# EAGLE design spinbitboard (EAGLE 7.2.0)
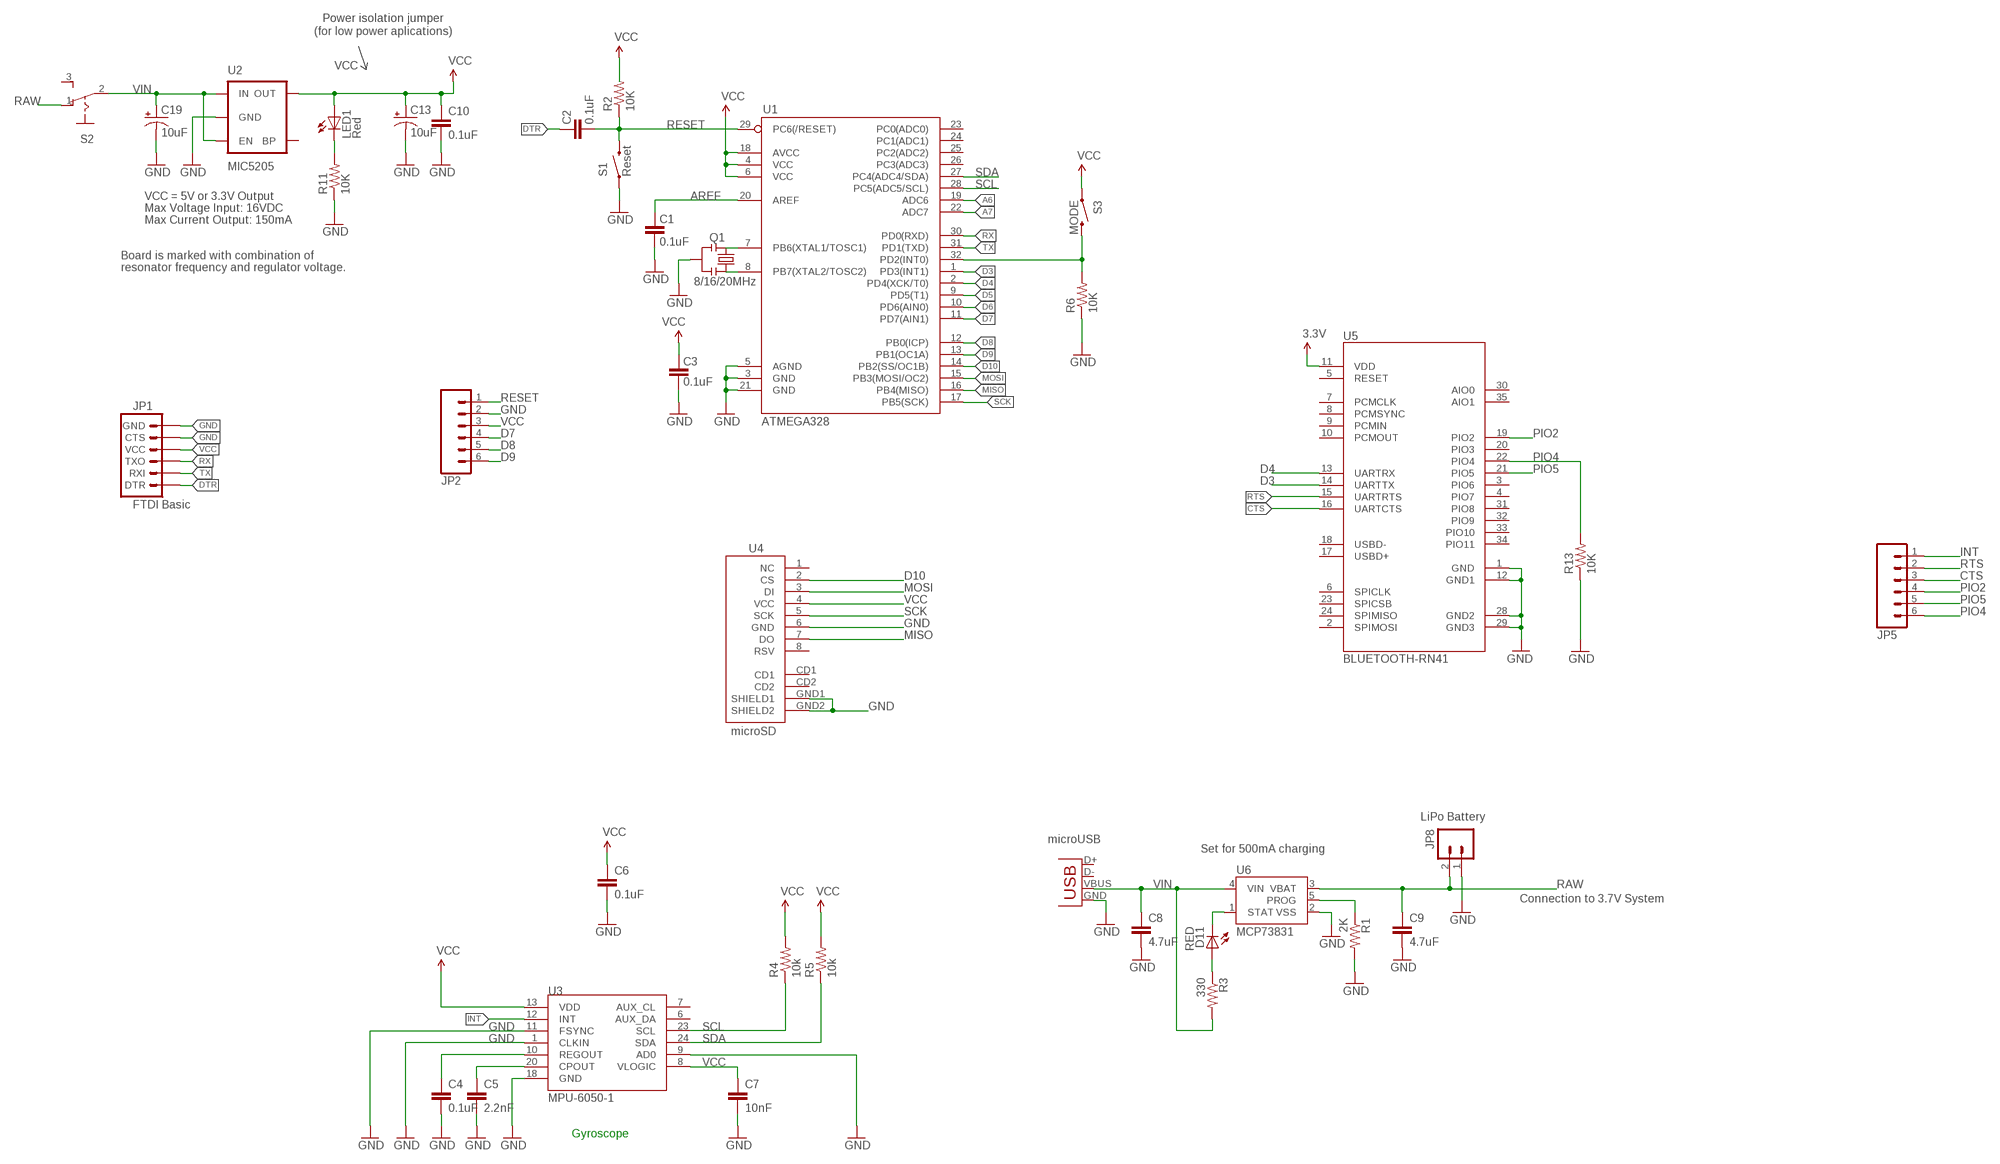
[diagram p0: schematic, sheet 1]

## Parts
C1  0.1uF  CAP0603-CAP  [0603-CAP]
C2  0.1uF  CAP0603-CAP  [0603-CAP]
C3  0.1uF  CAP0603-CAP  [0603-CAP]
C4  0.1uF  CAP0603-CAP  [0603-CAP]
C5  2.2nF  CAP0603-CAP  [0603-CAP]
C6  0.1uF  CAP0603-CAP  [0603-CAP]
C7  10nF  CAP0603-CAP  [0603-CAP]
C8  4.7uF  C-EUC0603  [C0603]
C9  4.7uF  C-EUC0603  [C0603]
C10  0.1uF  CAP0603-CAP  [0603-CAP]
C13  10uF  CAP_POL1206  [EIA3216]
C19  10uF  CAP_POL1206  [EIA3216]
D11  RED  LED0603  [LED-0603]
JP1  FTDI Basic  ARDUINO_SERIAL_PROGRAMPTH  [1X06]
JP2  M06SIP  [1X06]
JP5  M06SIP  [1X06]
JP8  LiPo Battery  M02-JST-2MM-SMT  [JST-2-SMD]
LED1  Red  LED  [0603-LED-ALT1]
Q1  8/16/20MHz  RESONATOR1:1  [RESONATOR-SMD-1:1]
R1  2K  R-US_R0603  [R0603]
R2  10K  RESISTOR0603-RES  [0603-RES]
R3  330  R-US_R0603  [R0603]
R4  10k  RESISTOR0603-RES  [0603-RES]
R5  10k  RESISTOR0603-RES  [0603-RES]
R6  10K  RESISTOR0603-RES  [0603-RES]
R11  10K  RESISTOR0603-RES  [0603-RES]
R13  10K  RESISTOR0603-RES  [0603-RES]
S1  Reset  SWITCH-MOMENTARY-2SMD-ALT01  [TACTILE-SWITCH-SMD-ALT01]
S2  255SB  [255SB]
S3  MODE  SWITCH-MOMENTARY-2SMD-ALT01  [TACTILE-SWITCH-SMD-ALT01]
U1  ATMEGA328  ATMEGA168  [TQFP32-08]
U2  MIC5205  V_REG_LDOSMD  [SOT23-5]
U3  MPU-6050-1  [QFN-24-4MM2]
U4  microSD  USD-SOCKETSMD  [MICRO-SD-SOCKET-PP]
U5  BLUETOOTH-RN41  BLUETOOTH-RN41"  [RN41]
U6  MCP73831  [SOT23-5]
X1  Micro USB  USB-MICROB  [USB-MICROB]

## Nets
3.3V: C6.1 R4.2 R5.2 S3.1 S3.2 U3.13(VDD) ; supply symbol labelled VCC
A6: U1.19(ADC6)
A7: U1.22(ADC7)
AREF: C1.2 U1.20(AREF)
CTS: JP5.3 U5.16(UARTCTS)
D2: R6.2 S3.3 S3.4 U1.32(PD2(INT0))
D3: U1.1(PD3(INT1)) U5.14(UARTTX)
D4: U1.2(PD4(XCK/T0)) U5.13(UARTRX)
D5: U1.9(PD5(T1))
D6: U1.10(PD6(AIN0))
D7: JP2.4 U1.11(PD7(AIN1))
D8: JP2.5 U1.12(PB0(ICP))
D9: JP2.6 U1.13(PB1(OC1A))
D10: U1.14(PB2(SS/OC1B)) U4.2(CS)
DTR: C2.2 JP1.1(DTR)
GND [vcc]: C1.1 C3.1 C4.2 C5.2 C6.2 C7.2 C8.2 C9.2 C10.2 C13.C(-) C19.C(-) JP1.5(CTS) JP1.6(GND) JP2.2 JP8.1 Q1.2 R1.2 R6.1 R11.1 R13.1 S1.1 S1.2 U1.3(GND) U1.5(AGND) U1.21(GND) U2.2(GND) U3.1(CLKIN) U3.9(AD0) U3.11(FSYNC) U3.18(GND) U4.6(GND) U4.GND1(SHIELD1) U4.GND2(SHIELD2) U5.1(GND) U5.12(GND1) U5.28(GND2) U5.29(GND3) U6.2(VSS) X1.GND
INT: JP5.1 U3.12(INT)
MISO: U1.16(PB4(MISO)) U4.7(DO)
MOSI: U1.15(PB3(MOSI/OC2)) U4.3(DI)
N$1: Q1.3 U1.8(PB7(XTAL2/TOSC2))
N$2: Q1.1 U1.7(PB6(XTAL1/TOSC1))
N$4: LED1.C R11.2
N$5: C5.1 U3.20(CPOUT)
N$6: C4.1 U3.10(REGOUT)
N$7: D11.A R3.1
PIO2: JP5.4 U5.19(PIO2)
PIO4: JP5.6 R13.2 U5.22(PIO4)
PIO5: JP5.5 U5.21(PIO5)
PROG: R1.1 U6.5(PROG)
RAW [vcc]: C9.1 JP8.2 S2.1(O) U6.3(VBAT)
RESET: C2.1 JP2.1 R2.1 S1.3 S1.4 U1.29(PC6(/RESET))
RTS: JP5.2 U5.15(UARTRTS)
RX: JP1.3(TXO) U1.30(PD0(RXD))
SCK: U1.17(PB5(SCK)) U4.5(SCK)
SCL: R4.1 U1.28(PC5(ADC5/SCL)) U3.23(SCL)
SDA: R5.1 U1.27(PC4(ADC4/SDA)) U3.24(SDA)
STAT: D11.C U6.1(STAT)
TX: JP1.2(RXI) U1.31(PD1(TXD))
VCC: C3.2 C7.1 C10.1 C13.A(+) JP1.4(VCC) JP2.3 LED1.A R2.2 U1.4(VCC) U1.6(VCC) U1.18(AVCC) U2.5(OUT) U3.8(VLOGIC) U4.4(VCC) U5.11(VDD) ; supply symbol labelled 3.3V
VIN: C8.1 C19.A(+) R3.2 S2.2(P) U2.1(IN) U2.3(EN) U6.4(VIN) X1.VBUS
Unconnected: S2.3(S) U1.23(PC0(ADC0)) U1.24(PC1(ADC1)) U1.25(PC2(ADC2)) U1.26(PC3(ADC3)) U2.4(BP) U3.6(AUX_DA) U3.7(AUX_CL) U4.1(NC) U4.8(RSV) U4.CD1 U4.CD2 U5.2(SPIMOSI) U5.3(PIO6) U5.4(PIO7) U5.5(RESET) U5.6(SPICLK) U5.7(PCMCLK) U5.8(PCMSYNC) U5.9(PCMIN) U5.10(PCMOUT) U5.17(USBD+) U5.18(USBD-) U5.20(PIO3) U5.23(SPICSB) U5.24(SPIMISO) U5.30(AIO0) U5.31(PIO8) U5.32(PIO9) U5.33(PIO10) U5.34(PIO11) U5.35(AIO1) X1.D+ X1.D-

## Notes on the sheet
- Power isolation jumper
- (for low power aplications)
- VCC = 5V or 3.3V Output
- Max Voltage Input: 16VDC
- Max Current Output: 150mA
- Board is marked with combination of
- resonator frequency and regulator voltage.
- microUSB
- Set for 500mA charging
- Connection to 3.7V System
- Gyroscope

## Library data of the parts
C1-C7 C10 = SparkFun:CAP: Capacitor Standard 0603 ceramic capacitor, and 0.1" leaded capacitor.
C8 C9 = resistor:C-EU: CAPACITOR, European symbol
C13 C19 = SparkFun:CAP_POL: Capacitor Polarized These are standard SMD and PTH capacitors. Normally 10uF, 47uF, and 100uF in electrolytic and tantalum varieties. Always verify the external diameter of the through hole cap, it varies with capacity, voltage, and manufacturer. The EIA devices should be standard.
D11 = SparkFun:LED: LEDs Standard schematic elements and footprints for 5mm, 3mm, 1206, and 0603 sized LEDs. 5mm - Spark Fun Electronics SKU : COM-00529 (and others)
JP1 = SparkFun:ARDUINO_SERIAL_PROGRAM
JP2 JP5 = SparkFun:M06: Header 6 Standard 6-pin 0.1" header. Use with straight break away headers (SKU : PRT-00116), right angle break away headers (PRT-00553), swiss pins (PRT-00743), machine pins (PRT-00117), and female headers (PRT-00115). Molex polarized connector foot print use with SKU : PRT-08094 with associated crimp pins and housings. NOTES ON THE VARIANTS LOCK and LOCK_LONGPADS... This footprint was designed to help hold the alignment of a through-hole component (i.e. 6-pin header) while soldering it into place. You may notice that each hole has been shifted either up or down by 0.005 of an inch from it's more standard position (which is a perfectly straight line). This slight alteration caused the pins (the squares in the middle) to touch the edges of the holes. Because they are alternating, it causes a "brace" to hold the component in place. 0.005 has proven to be the perfect amount of "off-center" position when using our standard breakaway headers. Although looks a little odd when you look at the bare footprint, once you have a header in there, the alteration is very hard to notice. Also, if you push a header all the way into place, it is covered up entirely on the bottom side. This idea of altering the position of holes to aid alignment will be further integrated into the Sparkfun Library for other footprints. It can help hold any component with 3 or more connection pins.
JP8 = SparkFun:M02: Header 2 Standard 2-pin 0.1" header. Use with straight break away headers (SKU : PRT-00116), right angle break away headers (PRT-00553), swiss pins (PRT-00743), machine pins (PRT-00117), and female headers (PRT-00115). Molex polarized connector foot print use with SKU : PRT-08233 with associated crimp pins and housings.
LED1 = Testing:LED: LEDs Standard schematic elements and footprints for 5mm, 3mm, 1206, and 0603 sized LEDs. 5mm - Spark Fun Electronics SKU : COM-00529 (and others)
Q1 = Testing:RESONATOR: Resonator Small SMD resonator. This is the itty bitty 10/20MHz resonators with built in caps. CSTCE10M0G55 and CSTCE20M0V53. Footprint for SMD has been used in SFE production for years, and does work okay. 1:1 is an attempt to get larger fillets on the sides so it will be easier to inspect these solders in our AOI machine. The pads have been minimized to match the actual metal under the resonator. To see this relation, it includes an image import of the bottom side of the component. Imported to scale on layer 200.
R1 R3 = resistor:R-US_: RESISTOR, American symbol
R2 R4-R6 R11 R13 = SparkFun:RESISTOR: Resistor Basic schematic elements and footprints for 0603, 1206, and PTH resistors.
S1 S3 = Testing:SWITCH-MOMENTARY-2: Various NO switches- pushbuttons, reed, etc
S2 = switch:255SB: SLIDING SWITCH Distributor Buerklin, 11G810
U1 = SparkFun:ATMEGA168
U2 = SparkFun:V_REG_LDO: Voltage Regulator LDO Standard 150mA LDO voltage regulator in SOT-23 layout. Micrel part MIC5205. BP (by-pass) pin is used to lower output noise with 470pF cap.
U3 = Testing:MPU-6050
U4 = SparkFun:USD-SOCKET: microSD Socket Push-push type uSD socket. Schematic element and footprint production proven. Spark Fun Electronics SKU : PRT-00127. tDoc lines correctly indicate media card edge positions when inserting (unlocked, locked, depressed).
U5 = SparkFun-RF:BLUETOOTH-RN41: Bluetooth SMD module
U6 = SparkFun:MCP73831: Microchip's MCP73831 Miniature single cell, fully integrated Li-Ion, Li-polymer charge management controller http://ww1.microchip.com/downloads/en/DeviceDoc/21984a.pdf
X1 = SparkFun:USB: USB Connectors USB-B-PTH is fully proven SKU : PRT-00139 USB-miniB is fully proven SKU : PRT-00587 USB-A-PCB is untested. USB-A-H is throughly reviewed, but untested. Spark Fun Electronics SKU : PRT-00437 USB-B-SMT is throughly reviewed, but untested. Needs silkscreen touching up. USB-A-S has not been used/tested USB-MB-H has not been used/tested

## Net classes
1 vcc: width 0.254 mm

## Board
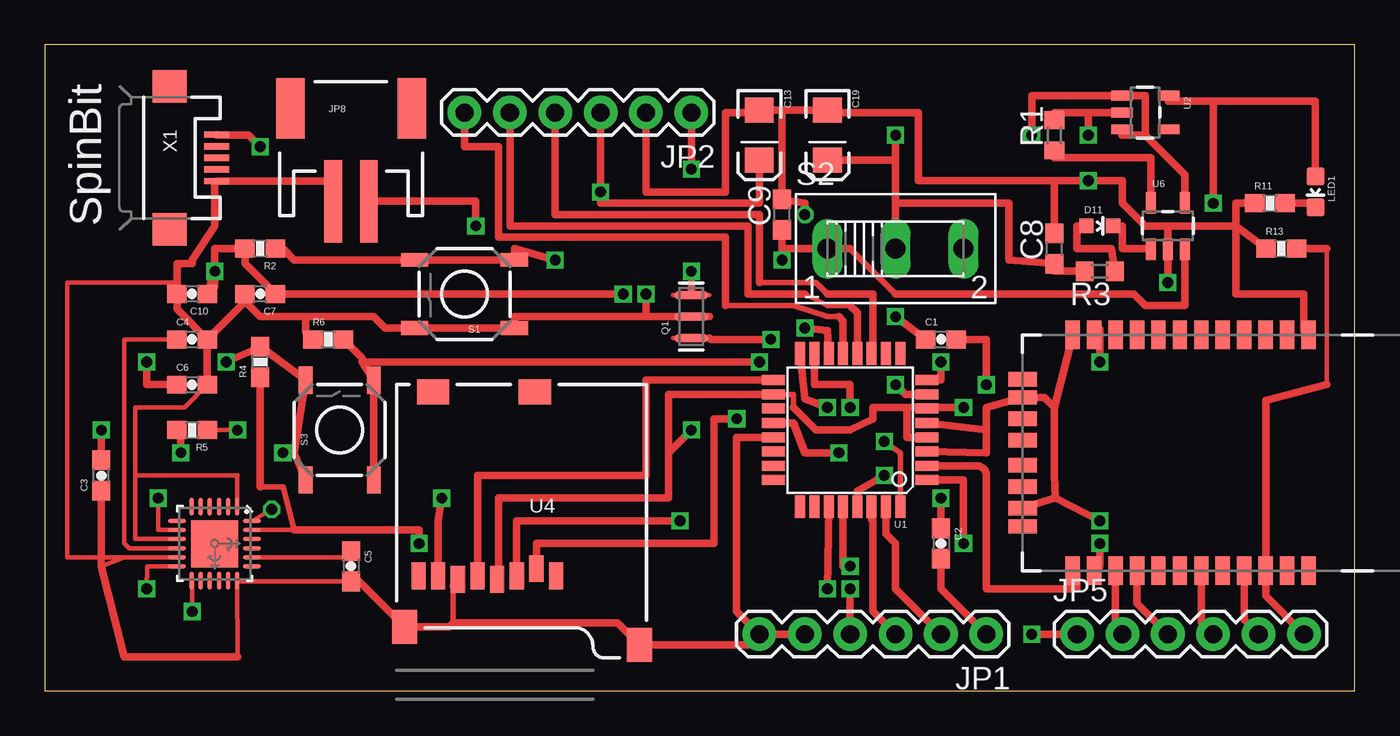
[diagram p1: board, top side]
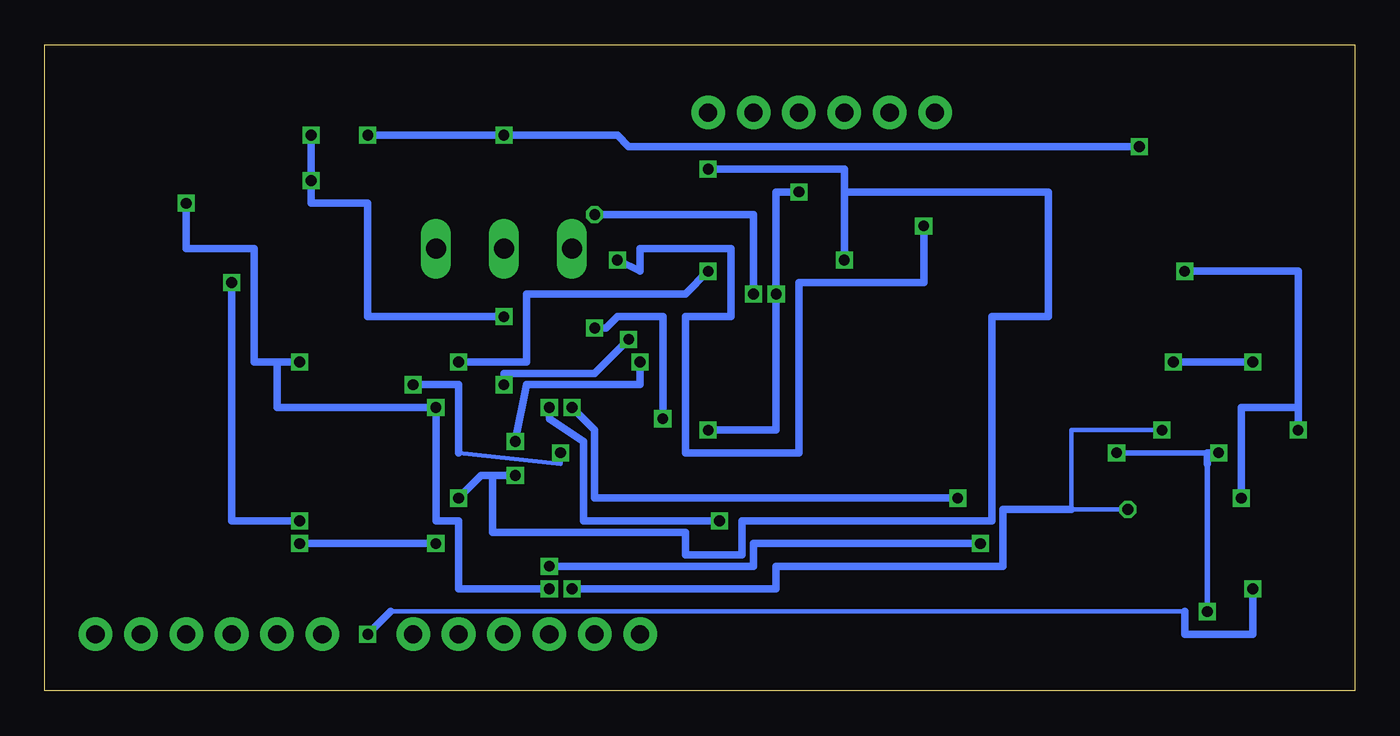
[diagram p2: board, bottom side, seen from below]

Size 73.33 x 36.18 mm. Coordinates in mm from the lower left corner, seen from the top.
Outline: 0,0 73.33,0 73.33,36.18 0,36.18 0,0
Copper layers (1*16): Top 0.0356mm / dielectric 1.5011mm / Bottom 0.0356mm
Design rules "LaenPCBOrder": minimum track width 6mil, minimum drill 13mil, track to track 6mil, track to pad 6mil, pad to pad 6mil, via to via 6mil, smd to smd 6mil, copper to edge 15mil, drill to drill 6mil, minimum pad ring 7mil, minimum via ring 7mil, stop-mask expansion 3mil, vias tented up to drill 0mil, thermal gap 10mil

### Footprints (pad centres in the part's own frame; a part is rotated, then mirrored left to right if it is on the bottom)
0603-CAP = smd 1.1 x 1: 1 -0.85,0; 2 0.85,0
C0603 = smd 1.1 x 1: 1 -0.85,0; 2 0.85,0
EIA3216 = smd 1.4 x 1.6: A 1.4,0; C -1.4,0
LED-0603 = smd 0.8 x 0.8: A 0,-0.75; C 0,0.75
1X06 = drill 1.016 pad 1.88: 1 0,0; 2 2.54,0; 3 5.08,0; 4 7.62,0; 5 10.16,0; 6 12.7,0
JST-2-SMD = smd 1 x 4.6: 1 -1,-3.7; 2 1,-3.7 | smd 1.6 x 3.4: NC1 -3.4,1.5; NC2 3.4,1.5
0603-LED-ALT1 = smd 1 x 1: A 0,-0.877; C 0,0.877
RESONATOR-SMD-1:1 = smd 0.45 x 1.905: 1 -1.2,0; 2 0,0; 3 1.2,0
R0603 = smd 1 x 1.1: 1 -0.85,0; 2 0.85,0
0603-RES = smd 1.1 x 1: 1 -0.85,0; 2 0.85,0
TACTILE-SWITCH-SMD-ALT01 = smd 1.524 x 0.762: 1 -2.794,1.905; 2 2.794,1.905; 3 -2.794,-1.905; 4 2.794,-1.905
255SB = drill 1.118 long: 1 -3.81,0; 2 0,0; 3 3.81,0
TQFP32-08 = smd 1.27 x 0.559: 1 -4.293,2.8; 2 -4.293,2; 3 -4.293,1.2; 4 -4.293,0.4; 5 -4.293,-0.4; 6 -4.293,-1.2; 7 -4.293,-2; 8 -4.293,-2.8; 17 4.293,-2.8; 18 4.293,-2; 19 4.293,-1.2; 20 4.293,-0.4; 21 4.293,0.4; 22 4.293,1.2; 23 4.293,2; 24 4.293,2.8 | smd 0.559 x 1.27: 9 -2.8,-4.293; 10 -2,-4.293; 11 -1.2,-4.293; 12 -0.4,-4.293; 13 0.4,-4.293; 14 1.2,-4.293; 15 2,-4.293; 16 2.8,-4.293; 25 2.8,4.293; 26 2,4.293; 27 1.2,4.293; 28 0.4,4.293; 29 -0.4,4.293; 30 -1.2,4.293; 31 -2,4.293; 32 -2.8,4.293
SOT23-5 = smd 0.55 x 1.2: 1 -0.95,-1.3; 2 0,-1.3; 3 0.95,-1.3; 4 0.95,1.3; 5 -0.95,1.3
QFN-24-4MM2 = smd 1.016 x 0.254: 1 -2.066,1.257; 2 -2.066,0.75; 3 -2.066,0.247; 4 -2.066,-0.287; 5 -2.066,-0.792; 6 -2.066,-1.297; 13 2.086,-1.297; 14 2.086,-0.792; 15 2.086,-0.287; 16 2.086,0.247; 17 2.086,0.75; 18 2.086,1.257 | smd 0.254 x 1.016: 7 -1.267,-2.122; 8 -0.762,-2.122; 9 -0.258,-2.122; 10 0.278,-2.122; 11 0.78,-2.122; 12 1.287,-2.122; 19 1.287,2.082; 20 0.78,2.082; 21 0.278,2.082; 22 -0.258,2.082; 23 -0.762,2.082; 24 -1.267,2.082 | smd 2.616 x 2.616: P$1 0.02,-0.01
MICRO-SD-SOCKET-PP = smd 0.8 x 1.5: 1 -8.94,10.7; 2 -7.84,10.3; 3 -6.74,10.7; 4 -5.64,10.9; 5 -4.54,10.7; 6 -3.44,10.9; 7 -2.34,10.7; 8 -1.24,10.7 | smd 1.8 x 1.4: CD1 -7.75,0.4; CD2 -2.05,0.4 | smd 1.4 x 1.9: GND1 -13.6,14.55; GND2 -0.45,13.55
RN41 = smd 0.8 x 1.6: 1 -6.6,-6.6; 2 -5.4,-6.6; 3 -4.2,-6.6; 4 -3,-6.6; 5 -1.8,-6.6; 6 -0.6,-6.6; 7 0.6,-6.6; 8 1.8,-6.6; 9 3,-6.6; 10 4.2,-6.6; 11 5.4,-6.6; 12 6.6,-6.6; 13 6.6,6.6; 14 5.4,6.6; 15 4.2,6.6; 16 3,6.6; 17 1.8,6.6; 18 0.6,6.6; 19 -0.6,6.6; 20 -1.8,6.6; 21 -3,6.6; 22 -4.2,6.6; 23 -5.4,6.6; 24 -6.6,6.6 | smd 1.6 x 0.8: 28 9.4,3.1; 29 9.4,-3.1; 30 9.4,4.122; 31 9.4,1.9; 32 9.4,0.7; 33 9.4,-0.7; 34 9.4,-1.9; 35 9.4,-4.122
USB-MICROB = smd 0.35 x 1.4: D+ 0,2.65; D- -0.65,2.65; GND 1.3,2.65; ID 0.65,2.65; VBUS -1.3,2.65 | smd 1.8 x 1.9: MT1 -4,0; MT2 4,0

### Placement (x,y rotation side)
C1  50.16,19.69 0 top
C2  50.16,8.26 270 top
C3  3.18,12.06 90 top
C4  8.26,19.69 0 top
C5  17.15,6.98 270 top
C6  8.26,17.15 0 top
C7  12.06,22.23 180 top
C8  56.51,24.77 90 top
C9  41.27,26.67 90 top
C10  8.26,22.23 180 top
C13  40.01,31.12 270 top
C19  43.82,31.12 270 top
D11  59.05,26.04 270 top
JP1  52.71,3.17 180 top
JP2  36.2,32.38 180 top
JP5  57.79,3.17 0 top
JP8  17.15,31.12 0 top
LED1  71.12,27.94 180 top
Q1  36.2,20.96 90 top
R1  56.51,31.12 90 top
R2  12.06,24.77 180 top
R3  59.05,23.5 180 top
R4  12.06,18.42 90 top
R5  8.26,14.61 180 top
R6  15.88,19.69 0 top
R11  68.58,27.31 0 top
R13  69.22,24.77 0 top
S1  23.49,22.23 180 top
S2  47.63,24.77 0 top
S3  16.51,14.61 90 top
U1  45.09,14.61 180 top
U2  61.6,32.38 270 top
U3  9.52,8.26 270 top
U4  19.69,17.15 180 top
U5  64.13,13.33 180 top
U6  62.87,26.04 0 top
X1  6.98,29.85 270 top

### Tracks (layer width: path | path; a pad name or v marks a point on that pad's centre or on a via)
3.3V  (via drill 0.6)
  Top 0.254: U3.13 8.26,6.17 v8.26,4.45 | R5.2 7.62,14.61
  Top 0.305: v13.34,13.33 13.97,13.33
  Top 0.406: S3.1 13.97,13.33 S3.2 12.1,19.27 R4.2 v10.16,18.42 | v5.72,18.42 5.72,17.15 C6.1 | 7.62,14.61 v7.62,13.33
  Bottom 0.305: v8.26,4.45 8.26,12.7 | 8.26,13.33 v13.34,13.33
  Bottom 0.406: v10.16,18.42 v5.72,18.42 | v7.62,13.33 8.26,13.33 8.26,12.7
AREF  (via drill 0.6)
  Top 0.406: v52.71,17.15 52.71,19.69 C1.2 | U1.20 41.91,15 42.54,13.33 v44.45,13.33
  Bottom 0.254: v44.45,13.33 44.45,12.7 50.16,13.33
  Bottom 0.406: 50.16,13.33 50.16,17.15 v52.71,17.15
CTS
  Top 0.406: U5.16 61.13,4.9 JP5.3
D2  (via drill 0.6)
  Top 0.305: v46.99,13.97 47.88,13.33 U1.32
  Top 0.406: S3.3 S3.4 17.78,18.42 | 17.78,18.42 17.78,18.63 R6.2 | v40.01,18.42 17.78,18.42
  Bottom 0.406: v40.01,18.42 40.01,17.15 46.35,17.15 v46.99,13.97
D3  (via drill 0.6)
  Top 0.406: U5.14 arc90 59.05,7.05 v59.05,8.26 | U1.1 51.43,11.8 v51.43,8.26
  Bottom 0.406: v59.05,8.26 v51.43,8.26
D4
  Top 0.406: U5.13 arc-90 57.79,6.48 57.79,5.71 52.71,5.71 52.71,12.06 arc90 52.16,12.61 U1.2
D7
  Top 0.305: 40.01,22.86 43.18,22.86 43.82,22.23
  Top 0.406: JP2.4 28.58,26.67 40.01,26.67 40.01,22.86 | 43.82,22.23 46.35,22.23 46.35,18.97 U1.11
D8
  Top 0.305: 45.09,21.59 43.82,21.59 42.54,22.23
  Top 0.406: U1.12 45.49,21.19 45.09,21.59 | 42.54,22.23 39.37,22.23 39.37,26.04 26.04,26.04 JP2.5
D9
  Top 0.305: 44.45,20.96 43.82,20.96 41.91,21.59 38.1,21.59
  Top 0.406: 38.1,21.59 38.1,25.4 25.4,25.4 25.4,30.48 23.49,30.48 JP2.6 | U1.13 44.68,20.72 44.45,20.96
D10  (via drill 0.6)
  Top 0.406: U4.2 27.52,8.26 37.46,8.26 37.46,15.24 v38.74,15.24 | v42.54,20.32 43.82,20.17 U1.14
  Bottom 0.406: v38.74,15.24 38.74,20.96 41.27,20.96 41.91,20.32 v42.54,20.32
DTR
  Top 0.406: JP1.1 50.16,5.71 C2.2
GND  (via drill 0.6)
  Top 0.254: C5.2 10.81,6.13 U3.18 10.8,1.91 | 3.18,6.98 4.45,7.47 U3.11 1.27,7.47 1.27,22.86 7.41,22.86 | U3.1 10.78,12.06 | 10.78,12.06 10.8,12.06 | 10.78,12.06 5.08,12.06 | 5.08,12.06 5.08,8.51 U3.9 | C6.2 7.84,15.88 5.08,15.88 5.08,12.06
  Top 0.305: 22.86,5.88 22.86,3.81
  Top 0.406: R13.1 66.68,26.04 | 66.68,26.04 66.68,22.23 70.49,22.23 70.49,20.19 U5.1 | 66.68,26.04 62.87,26.04 | 62.87,26.04 U6.2 v62.87,22.86 | R11.1 66.68,27.31 66.68,26.04 | v59.05,9.53 56.57,10.79 | 56.57,10.79 56.51,12.06 56.51,15.88 | 56.57,10.79 U5.28 | 56.51,15.88 55.96,16.44 U5.29 52.71,15.88 52.71,14.61 | U5.12 56.51,15.88 | JP1.5 JP1.6 | JP1.6 39.43,2.59 U4.GND1 32.07,3.81 22.86,3.81 22.65,3.59 U4.GND2 17.59,6.13 C5.2 | JP1.6 38.74,4.45 38.74,14.21 U1.21 | U4.6 22.86,5.88 | U2.2 58.42,32.38 | 58.42,32.38 56.51,32.38 R1.2 | v58.42,31.12 58.42,32.38 | 41.27,32.52 C19.C 43.82,32.38 48.9,32.38 48.9,28.58 56.51,28.58 | 41.27,32.52 C13.C 40.01,32.38 38.1,32.38 38.1,27.94 33.66,27.94 JP2.2 | C8.2 56.51,28.58 | 41.27,32.52 C9.2 42.54,27.32 v42.54,26.67 | JP8.1 15.88,27.69 15.88,28.58 15.84,28.55 X1.GND 9.52,28.44 9.52,26.04 8.26,24.13 8.26,23.92 7.41,23.92 7.41,22.86 C10.2 7.41,21.39 C4.2 | C7.2 11.22,21.8 | 11.22,21.8 C4.2 | C4.2 C6.2 | 14.6,20.96 18.41,20.96 19.05,20.32 S1.2 S1.1 26.29,20.96 33.66,20.96 | 14.6,20.96 14.6,20.11 R6.1 | 11.22,21.8 11.23,21.8 12.06,20.96 14.6,20.96 | 10.8,1.91 4.45,1.91 3.18,6.98 C3.1 | 52.71,14.61 U1.5 | U1.3 52.71,13.33 52.71,14.61 | C1.1 v47.63,20.96 | 56.51,28.58 v58.42,28.58 60.32,28.58 60.32,27.31 61.6,26.04 62.87,26.04 | 37.21,20.96 33.66,20.96 | v33.66,22.23 33.66,20.96
  Bottom 0.406: v62.87,22.86 62.87,9.53 v59.05,9.53 | v47.63,20.96 55.24,20.96 55.24,27.31 58.42,27.31 v58.42,28.58 v58.42,31.12 | v42.54,26.67 33.66,26.67 v33.66,22.23
INT  (via drill 0.6)
  Top 0.254: v5.72,5.71 5.73,6.97 U3.12
  Top 0.406: JP5.1 v55.24,3.17
  Bottom 0.254: 53.98,4.45 9.52,4.45
  Bottom 0.406: v55.24,3.17 53.98,4.45 | 9.52,4.45 9.52,3.17 5.72,3.17 v5.72,5.71
MISO  (via drill 0.6)
  Top 0.406: U4.7 22.02,9.53 v22.23,10.79 | v43.82,15.88 42.54,16.36 U1.16
  Bottom 0.406: v22.23,10.79 42.54,10.79 42.54,14.61 v43.82,15.88
MOSI  (via drill 0.6)
  Top 0.406: U4.3 26.42,9.53 v35.56,9.53 | v45.09,15.88 45.09,17.15 43.09,17.15 U1.15
  Bottom 0.406: v35.56,9.53 43.18,9.53 43.18,13.97 45.09,15.24 v45.09,15.88
N$1  (via drill 0.6)
  Top 0.406: U1.8 50.16,17.41 v50.16,18.42 | v36.2,23.5 Q1.3
  Bottom 0.406: v50.16,18.42 46.35,18.42 46.35,22.23 37.46,22.23 v36.2,23.5
N$2  (via drill 0.6)
  Top 0.406: U1.7 48.16,16.61 v47.63,17.15 | v40.64,19.69 37.28,19.69 37.21,19.76
  Bottom 0.406: v47.63,17.15 47.63,17.78 42.54,17.78 v40.64,19.69
N$4
  Top 0.406: R11.2 70.88,27.31 LED1.C
N$5
  Top 0.254: U3.20 16.79,7.47
  Top 0.406: 16.79,7.47 C5.1
N$6
  Top 0.254: C4.1 4.45,19.69 4.45,8.26 4.72,7.98 U3.10
N$7
  Top 0.406: D11.A 57.79,26.04 57.79,24.77 59.71,24.77 R3.1
PIO2
  Top 0.406: U5.19 64.74,3.84 JP5.4
PIO4
  Top 0.254: 71.75,17.15 71.75,24.77
  Top 0.406: 71.75,17.15 68.34,16.27 U5.22 68.34,5.33 JP5.6 | 71.75,24.77 R13.2
PIO5
  Top 0.406: U5.21 67.13,3.99 JP5.5
PROG
  Top 0.406: R1.1 56.51,29.85 61.91,29.85 U6.5
RAW  (via drill 0.6)
  Top 0.305: 47.63,22.23 45.09,24.77
  Top 0.406: U6.3 63.82,21.59 61.6,21.59 60.96,22.23 47.63,22.23 | 45.09,24.77 S2.1 41.27,24.77 | 41.27,24.77 C9.1 | JP8.2 24.13,27.42 v24.13,26.04 | v41.27,24.13 41.27,24.77
  Bottom 0.406: v24.13,26.04 24.13,22.86 31.12,22.86 31.12,13.33 37.46,13.33 37.46,20.96 34.92,20.96 34.92,24.77 40.01,24.77 40.01,23.5 v41.27,24.13
RESET  (via drill 0.6)
  Top 0.406: C2.1 v50.16,10.79 | v46.99,12.06 45.49,11.2 U1.29 | R2.1 13.34,24.77 13.97,24.13 S1.4 S1.3 26.29,24.77 v28.58,24.13 | JP2.1 v36.2,29.21
  Bottom 0.406: v50.16,10.79 48.9,12.06 48.26,12.06 | v36.2,29.21 28.58,29.21 28.58,27.94 | 28.58,27.94 v28.58,24.13 | v46.99,12.06 48.26,12.06 | 48.26,12.06 48.26,8.89 37.46,8.89 37.46,7.62 34.29,7.62 34.29,9.53 20.32,9.53 20.32,20.96 17.15,20.96 17.15,27.94 28.58,27.94
RTS
  Top 0.406: U5.15 59.93,3.57 JP5.2
RX
  Top 0.406: JP1.3 46.35,4.45 46.35,9.53 46.29,9.6 U1.30
SCK
  Top 0.406: U1.17 33.66,17.41 33.66,12.06 24.23,12.06 U4.5
SCL  (via drill 0.6)
  Top 0.254: U3.23 13.97,9.02
  Top 0.305: 12.06,11.43 13.34,11.43 13.97,9.02
  Top 0.406: 13.97,9.02 20.95,9.02 v20.95,8.26 | v45.09,6.98 44.68,6.98 U1.28 | R4.1 12.06,11.43
  Bottom 0.406: v20.95,8.26 33.66,8.26 33.66,6.98 v45.09,6.98
SDA  (via drill 0.6)
  Top 0.254: U3.24 v12.7,10.16 | v10.8,14.61 R5.1
  Top 0.406: v43.82,5.71 U1.27
  Bottom 0.254: v12.7,10.16 15.88,10.16 15.88,14.61 v10.8,14.61
  Bottom 0.406: 15.88,10.16 19.69,10.16 19.69,6.98 32.38,6.98 32.38,5.71 v43.82,5.71
STAT
  Top 0.406: D11.C 60.32,26.04 60.32,24.77 61.91,24.77 U6.1
TX
  Top 0.406: JP1.2 47.63,5.71 47.63,8.26 47.09,8.79 U1.31
VCC  (via drill 0.6)
  Top 0.254: U3.8 6.35,9.02 v6.35,10.79
  Top 0.305: 41.91,15.88 41.91,16.61 U1.18
  Top 0.406: U5.11 59.05,20.26 v59.05,18.42 | 34.92,13.33 34.92,10.79 25.4,10.79 25.4,6.25 U4.4 | 34.92,13.33 34.92,16.61 U1.18 | JP1.4 v45.09,5.71 | v51.43,15.88 49.38,15.88 | v9.52,23.5 9.52,24.77 R2.2 11.22,23.93 C7.1 v32.38,22.23 | v9.52,23.5 9.52,22.65 C10.1 v9.52,23.5 | JP2.3 v31.12,27.94 31.12,27.31 40.01,27.31 C13.A | v36.2,14.61 34.92,13.33 | C3.2 v3.18,14.61 | U1.4 48.26,14.21 48.26,15.88 | 48.26,15.88 49.38,15.88 | 49.38,15.88 U1.6 | 48.26,15.88 46.35,15.88 46.35,15.24 45.09,14.61 43.18,14.61 41.91,15.88 | v65.41,27.31 65.41,33.02 | 65.41,33.02 62.9,33.02 U2.5 | LED1.A 71.12,33.02 65.41,33.02
  Bottom 0.406: v59.05,18.42 60.32,18.42 | v65.41,27.31 65.41,24.77 61.6,24.77 61.6,18.42 60.32,18.42 | v45.09,5.71 50.16,5.71 50.16,9.53 51.43,9.53 v51.43,15.88 60.32,15.88 60.32,18.42 | v31.12,27.94 32.38,27.94 v32.38,22.23 32.38,14.61 v36.2,14.61 | v3.18,14.61 3.18,15.88 | 3.18,15.88 3.18,23.5 v9.52,23.5 | v6.35,10.79 6.35,15.88 3.18,15.88
VIN  (via drill 0.6)
  Top 0.406: R3.2 56.51,23.5 C8.1 53.98,24.12 53.98,27.31 47.63,27.31 | 43.82,29.85 C19.A 47.63,29.71 | S2.2 47.63,27.31 | 47.63,27.31 47.63,29.71 | X1.VBUS 9.63,31.12 11.43,31.12 v12.06,30.48 | v47.63,31.12 47.63,29.71 | v55.24,31.12 55.24,33.34 U2.1 61.6,33.34 61.6,31.12 | 61.6,31.12 60.29,31.12 U2.3 | U6.4 63.82,28.9 61.6,31.12
  Bottom 0.406: v12.06,30.48 40.64,30.48 41.27,31.12 v47.63,31.12 v55.24,31.12

### Text on the board
_tsilk: SpinBit